# EAGLE board moire_v2.7 (EAGLE 9.1.1)
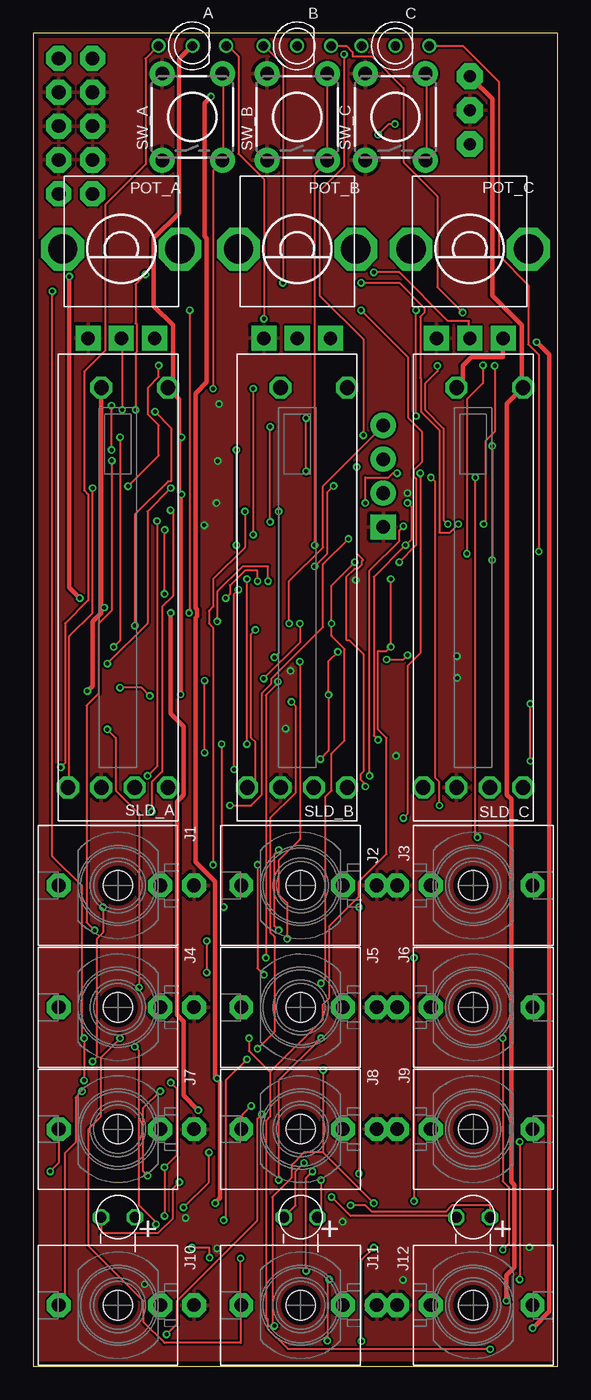
[diagram p3: board, top side]
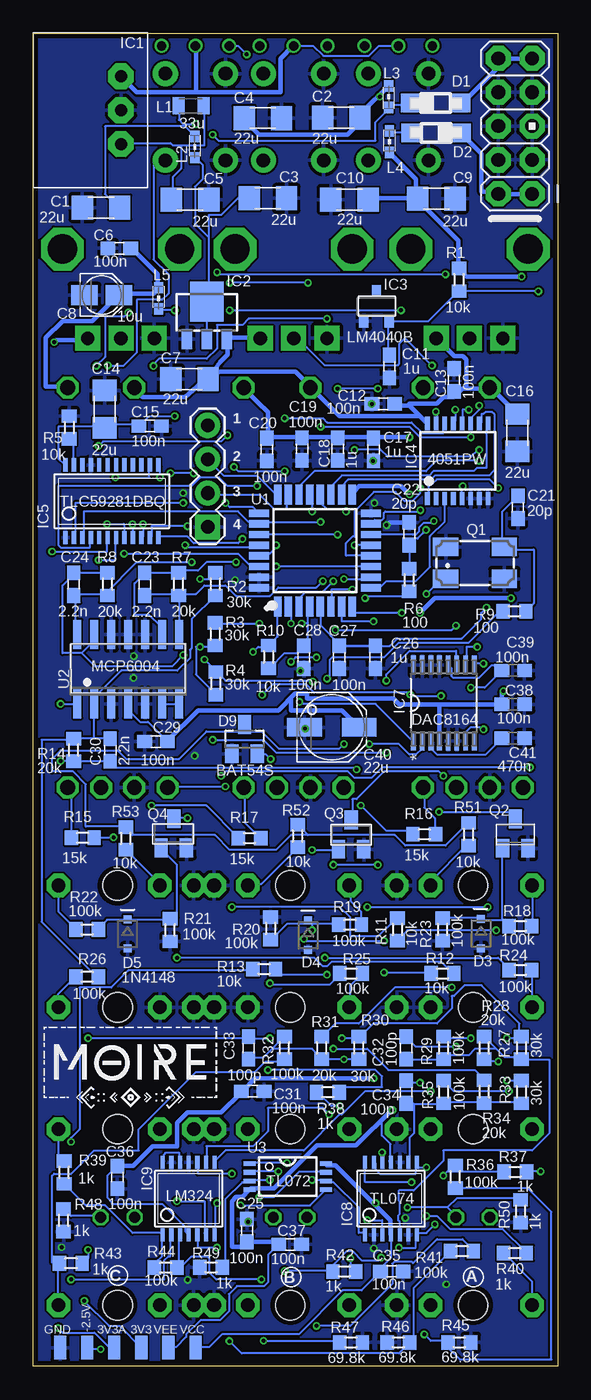
[diagram p4: board, bottom side, seen from below]

Size 39.35 x 100 mm. Coordinates in mm from the lower left corner, seen from the top.
Outline: 0,0 39.35,0 39.35,100 0,100 0,0
Copper layers (1*16): Top 0.035559375mm / dielectric 1.6mm / Bottom 0.035559375mm
Design rules "pcbway": minimum track width 6mil, minimum drill 0.3mm, track to track 6mil, track to pad 6mil, pad to pad 6mil, via to via 6mil, smd to smd 0mil, copper to edge 15mil, drill to drill 6mil, minimum pad ring 5mil, minimum via ring 5mil, stop-mask expansion 2.5mil, vias tented up to drill 15mil, thermal gap 10mil

## Footprints (pad centres in the part's own frame; a part is rotated, then mirrored left to right if it is on the bottom)
LED-BICOLOR-THROUGHHOLE-LUMEX = drill 0.7: A 0,0; GREEN_C 2.54,0; RED_C -2.54,0
LED3MM = drill 0.813 octagon: 1 -1.27,0; 2 1.27,0
RCL_C1206 = smd 1.6 x 1.8: 1 -1.4,0; 2 1.4,0
RCL_C0603 = smd 1.1 x 1: 1 -0.85,0; 2 0.85,0
RCL_PANASONIC_A = smd 2 x 1.5: + 1.3,0; - -1.3,0
C0603 = smd 1.1 x 1: 1 -0.85,0; 2 0.85,0
PANASONIC_C = smd 2.6 x 1.4: + 2.05,0; - -2.05,0
DIODE_SOD123 = smd 1.4 x 1.4: A 1.9,0; C -1.9,0
DIODE_SOD323-R = smd 0.6 x 0.6: A 1.1,0; C -1.1,0
SOT23 = smd 1 x 1.4: 1 -0.95,-1.1; 2 0.95,-1.1; 3 0,1.1
WE78 = drill 0.9 pad 1.93 octagon: 1 -2.54,0; 2 0,0; 3 2.54,0
SOT89 = smd 0.8 x 1.5: 1 -1.5,-1.75; 2 0,-1.75; 3 1.5,-1.75 | smd 2.5 x 3: 4 0,1.05
DBZ_R-PDSO-G3 = smd 0.7 x 1: 1 -0.95,-1.1; 2 0.95,-1.1; 3 0,1.1
TSSOP16_065 = smd 0.35 x 1: 1 -1.95,-2.825; 2 -1.3,-2.825; 3 -0.65,-2.825; 4 0,-2.825; 5 0.65,-2.825; 6 1.3,-2.825; 7 1.95,-2.825; 8 2.6,-2.825; 9 2.6,2.825; 10 1.95,2.825; 11 1.3,2.825; 12 0.65,2.825; 13 0,2.825; 14 -0.65,2.825; 15 -1.3,2.825; 16 -1.95,2.825
TSSOP24_0635 = smd 0.33 x 1: 1 -3.493,-2.725; 2 -2.857,-2.725; 3 -2.223,-2.725; 4 -1.587,-2.725; 5 -0.953,-2.725; 6 -0.318,-2.725; 7 0.318,-2.725; 8 0.953,-2.725; 9 1.587,-2.725; 10 2.223,-2.725; 11 2.857,-2.725; 12 3.493,-2.725; 13 3.493,2.725; 14 2.857,2.725; 15 2.223,2.725; 16 1.587,2.725; 17 0.953,2.725; 18 0.318,2.725; 19 -0.318,2.725; 20 -0.953,2.725; 21 -1.587,2.725; 22 -2.223,2.725; 23 -2.857,2.725; 24 -3.493,2.725
SOP65P640X110-16N = smd 1.422 x 0.356: 1 -2.845,2.286; 2 -2.845,1.626; 3 -2.845,0.965; 4 -2.845,0.33; 5 -2.845,-0.33; 6 -2.845,-0.965; 7 -2.845,-1.626; 8 -2.845,-2.286; 9 2.845,-2.286; 10 2.845,-1.626; 11 2.845,-0.965; 12 2.845,-0.33; 13 2.845,0.33; 14 2.845,0.965; 15 2.845,1.626; 16 2.845,2.286
TSSOP14_065 = smd 0.305 x 0.991: 1 -1.95,-2.718; 2 -1.3,-2.718; 3 -0.65,-2.718; 4 0,-2.718; 5 0.65,-2.718; 6 1.3,-2.718; 7 1.95,-2.718; 8 1.95,2.718; 9 1.3,2.718; 10 0.65,2.718; 11 0,2.718; 12 -0.65,2.718; 13 -1.3,2.718; 14 -1.95,2.718
WQP_PJ_301M6 = drill 1.016 pad 1.778 octagon: P1 0,-5.715; P2 0,-3.175; P3 0,4.445 | hole 2.2: 0,0
2X5-PTH = drill 1.016 pad 1.88 octagon: 1 -1.27,5.08; 2 1.27,5.08; 3 -1.27,2.54; 4 1.27,2.54; 5 -1.27,0; 6 1.27,0; 7 -1.27,-2.54; 8 1.27,-2.54; 9 -1.27,-5.08; 10 1.27,-5.08
1X04 = drill 1.016 pad 1.88 square: 1 0,0 | drill 1.016 pad 1.88: 2 2.54,0; 3 5.08,0; 4 7.62,0
L2012C = smd 0.9 x 1.25: 1 -0.9,0; 2 1,0
0603 = smd 0.85 x 0.7: 1 -0.9,0; 2 0.7,0
ALPS_POT_VERTICAL = drill 1 pad 1.88 square: P$1 -2.5,6.7; P$2 0,6.7; P$3 2.5,6.7 | drill 2.2 pad 3.175 octagon: P$4 -4.4,0; P$5 4.4,0
CTS406 = smd 1.9 x 1.4: 1 -2.2,-1.2; 2 2.2,-1.2; 3 2.2,1.2; 4 -2.2,1.2
SOT23-BEC = smd 1 x 1.4: B -0.95,-1.1; C 0,1.1; E 0.95,-1.1
RCL_R0603 = smd 1 x 1.1: 1 -0.85,0; 2 0.85,0
BOURNS_SLIDER = drill 1.1 octagon: 1 -15,1.25; 2 -15,3.75; 3 15,1.25; B 15,-3.75; DUMMY -15,-1.25; E -15,-3.75
TACTILE-PTH = drill 1.016 pad 1.88: 1 -3.251,2.261; 2 3.251,2.261; 3 -3.251,-2.261; 4 3.251,-2.261
QFP80P900X900X160-32N = smd 1.5 x 0.55: 1 -4.2,2.8; 2 -4.2,2; 3 -4.2,1.2; 4 -4.2,0.4; 5 -4.2,-0.4; 6 -4.2,-1.2; 7 -4.2,-2; 8 -4.2,-2.8; 17 4.2,-2.8; 18 4.2,-2; 19 4.2,-1.2; 20 4.2,-0.4; 21 4.2,0.4; 22 4.2,1.2; 23 4.2,2; 24 4.2,2.8 | smd 0.55 x 1.5: 9 -2.8,-4.2; 10 -2,-4.2; 11 -1.2,-4.2; 12 -0.4,-4.2; 13 0.4,-4.2; 14 1.2,-4.2; 15 2,-4.2; 16 2.8,-4.2; 25 2.8,4.2; 26 2,4.2; 27 1.2,4.2; 28 0.4,4.2; 29 -0.4,4.2; 30 -1.2,4.2; 31 -2,4.2; 32 -2.8,4.2
SO14 = smd 0.6 x 2.2: 1 -3.81,-2.6; 2 -2.54,-2.6; 3 -1.27,-2.6; 4 0,-2.6; 5 1.27,-2.6; 6 2.54,-2.6; 7 3.81,-2.6; 8 3.81,2.6; 9 2.54,2.6; 10 1.27,2.6; 11 0,2.6; 12 -1.27,2.6; 13 -2.54,2.6; 14 -3.81,2.6
TSSOP-8 = smd 0.9 x 0.35: 1 -2.875,0.975; 2 -2.875,0.325; 3 -2.875,-0.325; 4 -2.875,-0.975; 5 2.875,-0.975; 6 2.875,-0.325; 7 2.875,0.325; 8 2.875,0.975
6X1-SMD-TESTPAD = smd 0.914 x 1.778: 1 0,0.123; 2 -2.032,0.123; 3 -4.064,0.123; 4 -6.096,0.123; 5 -8.128,0.123; 6 -10.16,0.123

## Placement (x,y rotation side)
A  SSL-LX3059IGW-CA  [LED-BICOLOR-THROUGHHOLE-LUMEX]  11.94,99.06 180 top
A_LED  WP937EGW  [LED3MM]  6.35,11.18 0 top
B  SSL-LX3059IGW-CA  [LED-BICOLOR-THROUGHHOLE-LUMEX]  19.81,99.06 180 top
B_LED  WP937EGW  [LED3MM]  20.07,11.18 0 top
C  SSL-LX3059IGW-CA  [LED-BICOLOR-THROUGHHOLE-LUMEX]  27.18,99.06 180 top
C1  22u  [RCL_C1206]  34.26,86.92 180 bottom
C2  22u  [RCL_C1206]  16.23,93.68 180 bottom
C3  22u  [RCL_C1206]  21.74,87.63 0 bottom
C4  22u  [RCL_C1206]  22.12,93.65 0 bottom
C5  22u  [RCL_C1206]  27.58,87.5 0 bottom
C6  100n  [RCL_C0603]  32.89,83.87 180 bottom
C7  22u  [RCL_C1206]  27.64,74.07 180 bottom
C8  10u  [RCL_PANASONIC_A]  34.21,80.37 0 bottom
C9  22u  [RCL_C1206]  9.09,87.6 180 bottom
C10  22u  [RCL_C1206]  15.62,87.53 0 bottom
C11  1u  [RCL_C0603]  12.62,75.01 270 bottom
C12  100n  [RCL_C0603]  13.08,72.21 180 bottom
C13  100n  [RCL_C0603]  7.77,73.99 90 bottom
C14  22u  [RCL_C1206]  33.99,71.81 90 bottom
C15  100n  [RCL_C0603]  30.58,70.54 0 bottom
C16  22u  [RCL_C1206]  3.02,70.03 270 bottom
C17  1u  [RCL_C0603]  13.82,68.78 270 bottom
C18  1u  [RCL_C0603]  16.51,68.81 270 bottom
C19  100n  [RCL_C0603]  19.18,68.81 270 bottom
C20  100n  [RCL_C0603]  21.82,68.78 270 bottom
C21  20p  [RCL_C0603]  2.97,64.44 90 bottom
C22  20p  [RCL_C0603]  11.13,62.46 270 bottom
C23  2.2n  [RCL_C0603]  30.99,58.67 270 bottom
C24  2.2n  [RCL_C0603]  36.32,58.67 270 bottom
C25  100n  [RCL_C0603]  23.32,10.19 270 bottom
C26  1u  [RCL_C0603]  13.67,53.19 270 bottom
C27  100n  [RCL_C0603]  16.38,53.19 270 bottom
C28  100n  [RCL_C0603]  19.05,53.19 270 bottom
C29  100n  [RCL_C0603]  30.15,46.86 180 bottom
C30  2.2n  [RCL_C0603]  33.58,46.23 270 bottom
C31  100n  [RCL_C0603]  22.89,20.62 0 bottom
C32  100p  [RCL_C0603]  11.35,23.88 90 bottom
C33  100p  [RCL_C0603]  23.19,23.88 90 bottom
C34  100p  [RCL_C0603]  11.35,20.57 90 bottom
C35  100n  [RCL_C0603]  12.45,7.11 0 bottom
C36  100n  [RCL_C0603]  33.05,14.17 270 bottom
C37  100n  [RCL_C0603]  20.07,9.14 180 bottom
C38  100n  [C0603]  3.33,49.66 0 bottom
C39  100n  [C0603]  3.33,52.2 0 bottom
C40  22u  [PANASONIC_C]  16.94,47.93 0 bottom
C41  470n  [C0603]  3.33,47.12 0 bottom
C_LED  WP937EGW  [LED3MM]  33.02,11.18 0 top
D1  1N5819  [DIODE_SOD123]  9.14,94.77 0 bottom
D2  1N5819  [DIODE_SOD123]  9.12,92.53 180 bottom
D3  1N4148  [DIODE_SOD323-R]  5.74,32.46 270 bottom
D4  1N4148  [DIODE_SOD323-R]  18.72,32.33 270 bottom
D5  1N4148  [DIODE_SOD323-R]  32.28,32.44 270 bottom
D9  BAT54S  [SOT23]  23.5,47.04 0 bottom
IC1  R-78E3.3-0.5  [WE78]  32.77,94.23 90 bottom
IC2  AP7380  [SOT89]  26.31,78.82 0 bottom
IC3  LM4040B  [DBZ_R-PDSO-G3]  13.59,79.5 0 bottom
IC4  4051PW  [TSSOP16_065]  7.82,67.92 0 bottom
IC5  TLC59281DBQ  [TSSOP24_0635]  33.45,64.9 0 bottom
IC7  DAC8164  [SOP65P640X110-16N]  8.53,49.76 90 bottom
IC8  TL074  [TSSOP14_065]  12.5,12.57 0 bottom
IC9  LM324  [TSSOP14_065]  27.69,12.57 0 bottom
J1  PJ301_THONKICONN6  [WQP_PJ_301M6]  6.35,36.07 90 top
J2  PJ301_THONKICONN6  [WQP_PJ_301M6]  20.07,36.07 90 top
J3  PJ301_THONKICONN6  [WQP_PJ_301M6]  33.02,36.07 270 top
J4  PJ301_THONKICONN6  [WQP_PJ_301M6]  6.35,26.92 90 top
J5  PJ301_THONKICONN6  [WQP_PJ_301M6]  20.07,26.92 90 top
J6  PJ301_THONKICONN6  [WQP_PJ_301M6]  33.02,26.92 270 top
J7  PJ301_THONKICONN6  [WQP_PJ_301M6]  6.35,17.78 90 top
J8  PJ301_THONKICONN6  [WQP_PJ_301M6]  20.07,17.78 90 top
J9  PJ301_THONKICONN6  [WQP_PJ_301M6]  33.02,17.78 270 top
J10  PJ301_THONKICONN6  [WQP_PJ_301M6]  6.35,4.57 90 top
J11  PJ301_THONKICONN6  [WQP_PJ_301M6]  20.07,4.57 90 top
J12  PJ301_THONKICONN6  [WQP_PJ_301M6]  33.02,4.57 270 top
JP1  M05X2PTH  [2X5-PTH]  3.17,93.04 180 bottom
JP2  [1X04]  26.26,62.97 90 bottom
L1  33u  [L2012C]  27.56,94.56 0 bottom
L2  [0603]  27.23,91.57 90 bottom
L3  [0603]  12.67,95.15 270 bottom
L4  [0603]  12.62,91.97 90 bottom
L5  [0603]  29.95,80.21 90 bottom
POT_A  10kB  [ALPS_POT_VERTICAL]  6.6,83.82 180 top
POT_B  10kB  [ALPS_POT_VERTICAL]  19.81,83.82 180 top
POT_C  10kB  [ALPS_POT_VERTICAL]  32.77,83.82 180 top
Q1  8MHz  [CTS406]  6.2,60.27 0 bottom
Q2  MMBT3904  [SOT23-BEC]  3.17,39.95 0 bottom
Q3  MMBT3904  [SOT23-BEC]  15.49,39.88 0 bottom
Q4  MMBT3904  [SOT23-BEC]  28.8,39.98 0 bottom
R1  10k  [RCL_R0603]  7.39,81.51 270 bottom
R2  30k  [RCL_R0603]  25.68,58.67 90 bottom
R3  30k  [RCL_R0603]  25.7,54.91 270 bottom
R4  30k  [RCL_R0603]  25.65,51.23 270 bottom
R5  10k  [RCL_R0603]  36.65,70.43 90 bottom
R6  100  [RCL_R0603]  11.13,58.98 90 bottom
R7  20k  [RCL_R0603]  28.45,58.67 90 bottom
R8  20k  [RCL_R0603]  33.78,58.67 90 bottom
R9  100  [RCL_R0603]  3.23,56.64 0 bottom
R10  10k  [RCL_R0603]  21.69,53.21 270 bottom
R11  10k  [RCL_R0603]  12.01,32.77 270 bottom
R12  10k  [RCL_R0603]  8.64,29.46 180 bottom
R13  10k  [RCL_R0603]  22.02,29.79 0 bottom
R14  20k  [RCL_R0603]  36.32,46.23 90 bottom
R15  15k  [RCL_R0603]  35.64,39.65 0 bottom
R16  15k  [RCL_R0603]  10.01,39.9 180 bottom
R17  15k  [RCL_R0603]  23.11,39.62 180 bottom
R18  100k  [RCL_R0603]  2.79,33.02 180 bottom
R19  100k  [RCL_R0603]  15.57,33.12 180 bottom
R20  100k  [RCL_R0603]  21.54,32.84 270 bottom
R21  100k  [RCL_R0603]  29.08,32.72 90 bottom
R22  100k  [RCL_R0603]  35.31,32.77 0 bottom
R23  100k  [RCL_R0603]  8.64,32.77 90 bottom
R24  100k  [RCL_R0603]  2.79,29.72 0 bottom
R25  100k  [RCL_R0603]  15.49,29.46 0 bottom
R26  100k  [RCL_R0603]  35.31,29.21 180 bottom
R27  30k  [RCL_R0603]  2.72,23.88 90 bottom
R28  20k  [RCL_R0603]  5.51,23.88 270 bottom
R29  100k  [RCL_R0603]  8.56,23.88 270 bottom
R30  30k  [RCL_R0603]  14.91,23.88 90 bottom
R31  20k  [RCL_R0603]  17.7,23.88 90 bottom
R32  100k  [RCL_R0603]  20.5,23.88 90 bottom
R33  30k  [RCL_R0603]  2.72,20.57 90 bottom
R34  20k  [RCL_R0603]  5.51,20.6 90 bottom
R35  100k  [RCL_R0603]  8.56,20.57 270 bottom
R36  100k  [RCL_R0603]  7.67,14.22 270 bottom
R37  1k  [RCL_R0603]  3.17,14.58 180 bottom
R38  1k  [RCL_R0603]  17.25,20.55 0 bottom
R39  1k  [RCL_R0603]  37.03,14.53 270 bottom
R40  1k  [RCL_R0603]  3.2,8.48 0 bottom
R41  100k  [RCL_R0603]  7.16,8.64 180 bottom
R42  1k  [RCL_R0603]  16,7.11 180 bottom
R43  1k  [RCL_R0603]  36.53,7.72 0 bottom
R44  100k  [RCL_R0603]  29.41,7.39 0 bottom
R45  69.8k  [RCL_R0603]  7.37,1.78 0 bottom
R46  69.8k  [RCL_R0603]  11.94,1.78 180 bottom
R47  69.8k  [RCL_R0603]  15.49,1.78 0 bottom
R48  1k  [RCL_R0603]  37.08,10.95 270 bottom
R49  1k  [RCL_R0603]  26.01,7.42 180 bottom
R50  1k  [RCL_R0603]  2.77,11.63 270 bottom
R51  10k  [RCL_R0603]  6.68,39.9 270 bottom
R52  10k  [RCL_R0603]  19.51,39.78 270 bottom
R53  10k  [RCL_R0603]  32.41,39.6 270 bottom
SLD_A  20kB  [BOURNS_SLIDER]  6.35,58.42 90 top
SLD_B  20kB  [BOURNS_SLIDER]  19.81,58.42 90 top
SLD_C  20kB  [BOURNS_SLIDER]  33.02,58.42 90 top
SW_A  [TACTILE-PTH]  11.94,93.73 90 top
SW_B  [TACTILE-PTH]  19.81,93.73 90 top
SW_C  [TACTILE-PTH]  27.18,93.73 90 top
U1  STM32F303K8T6  [QFP80P900X900X160-32N]  18.21,61.19 90 bottom
U2  MCP6004  [SO14]  32.23,52.3 0 bottom
U3  TL072  [TSSOP-8]  20.24,14.22 0 bottom
U$1  1X6-SMD-TESTPAD  [6X1-SMD-TESTPAD]  27.18,1.27 0 bottom

## Tracks (layer width: path | path; a pad name or v marks a point on that pad's centre or on a via)
+3V3  (via drill 0.3)
  Top 0.152: v22.86,53.59 22.17,52.91 v22.17,50.37 22.17,46.18 v21.54,45.54 | v6.5,50.9 8.13,50.9 v8.74,50.29
  Top 0.356: 10.95,69.69 10.95,72.55 10.16,73.34 SLD_A.B 10.48,73.18 10.48,78.11 9.05,79.53 9.05,84.61 10.95,86.52 10.95,98.11 11.91,99.06 A.A | 10.95,69.69 10.95,65.56 v11.11,65.41 11.05,65.41 v11.05,50.39 | v35.52,4.91 35.52,6.83 36.11,7.42 36.11,13.59 35.88,13.82 35.88,42.55 35.56,42.86 35.56,72.23 36.67,73.34 SLD_C.B 36.67,73.5 36.67,78.11 34.45,80.33 34.45,95.09 32.86,96.68 IC1.3 | v11.11,69.69 10.95,69.69
  Bottom 0.152: B.A 18.34,99.06 17.58,98.31 14.17,98.31 13.41,99.06 A.A | v35.52,4.91 35.52,4.87 33.66,3.02 32.86,3.02 U$1.3 | 4.29,52.07 4.82,52.6 4.94,52.6 5.88,51.66 7.84,51.66 7.98,51.8 7.98,52.38 IC7.12 | R10.1 21.01,54.74 U1.1 | v22.17,50.37 21.41,51.13 18.86,51.13 18.27,50.54 11.05,50.54 v11.05,50.39 10.95,50.29 v8.74,50.29 | v22.86,53.59 22.48,53.98 21.75,53.98 | v21.54,45.54 21.88,45.88 22.54,45.88 | C39.1 5.47,50.9 v6.5,50.9
  Bottom 0.356: 4.29,52.07 C39.1 | 22.54,45.88 D9.2 | 21.75,53.98 R10.1 | U1.17 14.89,66.04 11.75,66.04 v11.11,65.41 | 27.15,95.57 31.59,95.57 32.7,96.68 IC1.3 | 27.15,95.57 20.8,95.57 20.8,98.11 19.84,99.06 B.A | C.A 27.15,99.06 27.15,95.73 27.15,95.57 | SLD_B.B 23.5,73.34 22.46,72.31 21.75,71.6 21.75,69.85 C20.1 21.75,69.69 19.21,69.69 C19.1 19.05,69.69 16.67,69.69 C18.1 16.51,69.69 13.97,69.69 C17.1 13.65,69.69 v11.11,69.69 | C6.1 31.91,83.82 30,81.92 30,80.96 L5.2 30,80.8 30.32,80.49 32.86,80.49 C8.+ 33.02,80.33 34.92,78.42 37.15,78.42 38.42,77.15 38.42,73.5 36.83,73.5 SLD_C.B
+3V3_A  (via drill 0.3)
  Top 0.152: v5.33,56.92 5.08,57.18 5.08,57.33
  Top 0.356: v37.48,2.85 38.73,4.11 38.73,75.88 v37.78,76.83 | SLD_C.3 31.91,73.5 32.23,73.82 32.23,75.06 32.89,75.72 35.24,75.72 35.24,76.99 POT_C.P$1 | v4.06,50.64 4.45,51.03 4.45,55.88 5.08,56.52 5.08,57.33 5.08,73.34 SLD_A.3
  Bottom 0.152: U2.4 32.23,49.24 31.33,48.35 30.75,48.35 29.3,46.9 | v37.48,2.85 37.14,2.51 34.75,2.51 33.64,1.39 U$1.4 | U1.5 17.81,55.59 16.35,54.13 | C26.1 C27.1 12.59,54.04 12.03,54.6 7.19,54.6 5.74,56.05 5.74,56.52 v5.33,56.92
  Bottom 0.356: IC7.4 8.86,49.64 | 16.35,54.13 C27.1 | C40.+ 14.92,47.94 16.19,49.21 20,49.21 20,49.37 20,50.16 19.71,50.46 | 19.71,50.46 19.56,50.46 18.8,50.46 18.8,50.09 12.32,50.09 11.86,49.64 8.86,49.64 | 11.11,72.07 10.4,71.36 | 10.4,71.36 9.84,70.8 IC4.16 | 11.11,72.07 12.22,72.07 C12.1 | 6.83,73.34 5.24,73.34 SLD_A.3 5,73.42 3.02,71.44 C16.1 | 6.83,73.34 7.14,73.34 7.33,73.16 C13.1 7.79,72.71 8.57,72.71 9.05,72.23 11.11,72.23 11.11,72.07 | 6.83,73.34 6.83,73.5 6.83,75.53 7.09,75.79 7.75,75.79 9.07,77.12 POT_A.P$1 | POT_B.P$1 22.38,77.15 24.76,77.15 IC2.3 24.77,76.66 24.77,75.88 25.32,75.33 C7.1 | C7.1 25.33,74.61 19.68,74.61 18.57,73.5 SLD_B.3 18.41,73.34 16.35,71.28 10.48,71.28 10.4,71.36 | SLD_C.3 31.75,73.34 31.13,72.72 27.97,72.72 26.42,74.07 C7.1 | v37.78,76.83 37.62,76.99 35.4,76.99 POT_C.P$1 | C29.1 29.3,46.9 26.99,49.21 25.38,49.21 20.95,49.21 19.71,50.46 | 8.86,49.64 8.73,49.64 8.1,49.64 4.19,49.64 C38.1 4.18,50.51 v4.06,50.64
+12V
  Bottom 0.356: D1.A 7.14,94.77 4.45,97.47 4.45,98.11 JP1.10 4.29,98.11 1.91,98.11 JP1.9
-12V
  Bottom 0.356: D2.C 7.14,92.39 5.71,90.96 5.71,88.11 4.45,88.11 JP1.2 4.29,87.95 1.91,87.95 JP1.1
A_CV  (via drill 0.3)
  Top 0.152: v11.69,56.52 11.75,56.57 v11.75,79.22 | v24.61,79.22 28.12,75.7 28.12,71.17 29.16,70.14 29.16,67.81 28.55,67.2 28.55,66.78 28.73,66.59 28.73,61.59 v27.46,60.33
  Bottom 0.152: 33.97,57.94 36.2,57.94 C24.2 36.2,57.78 36.2,54.93 U2.14 | 33.97,57.94 33.81,57.94 R8.1 33.97,57.94 | v11.69,56.52 15.08,56.52 15.4,56.83 U1.8 | v24.61,79.22 v11.75,79.22 | v27.46,60.33 31.59,60.33 33.97,57.94
A_CV_IN
  Bottom 0.152: R24.2 1.91,29.69 1.91,26.99 J4.P3
A_GATE  (via drill 0.3)
  Top 0.152: v4.6,32.7 3.99,33.31 3.99,49.55 4.92,50.48 4.92,55.72 5.9,56.7 v5.9,67.93
  Bottom 0.152: v4.6,32.7 11.27,32.7 12,31.97 R11.2 | U1.22 19.37,65.41 19.37,66.04 18.26,67.15 9.88,67.15 9.11,67.93 v5.9,67.93
A_GATE_OUT  (via drill 0.3)
  Top 0.152: v1.27,14.61 1.91,15.24 J7.P3
  Bottom 0.152: v1.27,14.61 2.22,14.61 R37.1
A_LED  (via drill 0.3)
  Top 0.152: v10.95,13.81 10.48,13.34 10.48,11.11 9.37,10 5.08,10 5.08,11.11 A_LED.1
  Bottom 0.152: v10.95,13.81 14.45,13.81 14.45,15.24 IC8.14
A_OUT  (via drill 0.3)
  Top 0.152: v3.65,20.64 3.17,20.16 3.17,16.79 2.36,15.98 2.36,5.06 1.91,4.6 J10.P3
  Bottom 0.152: R40.1 3.97,8.41 1.91,6.35 1.91,4.6 J10.P3 | v3.65,20.64 7.78,20.64 8.41,21.27 R35.1
A_POT  (via drill 0.3)
  Top 0.152: v6.67,71.75 6.67,76.99 POT_A.P$2
  Bottom 0.152: v6.67,71.75 7.14,71.75 7.14,70.8 IC4.12
A_SLD  (via drill 0.3)
  Top 0.152: v4.45,65.88 4.45,56.52 2.7,54.77 2.7,43.5 SLD_A.2
  Bottom 0.152: IC4.1 9.68,65.25 9.68,66.19 9.66,66.21 9.39,66.21 9.07,66.53 5.09,66.53 v4.45,65.88
A_TRIG  (via drill 0.3)
  Top 0.152: v8.89,41.59 8.89,43.81 9.68,44.61 9.68,56.99 10.48,57.78 10.48,64.03 v10.29,64.22
  Bottom 0.152: v8.89,41.59 3.65,41.59 3.17,41.12 Q2.C | v10.29,64.22 10.38,64.14 12.93,64.14 13.03,64.03 13.03,63.62 13.17,63.48 13.71,63.48 U1.15
A_TRIG_IN
  Bottom 0.152: R18.1 1.91,33.02 1.91,36.04 J1.P3
ADC_TIME_SHAPE
  Bottom 0.152: U1.9 13.97,58.42 13.34,58.42 12.86,58.9 10.64,58.9 9.58,59.96 9.58,62.27 8.47,63.37 IC4.3
AREF_-2.5  (via drill 0.3)
  Top 0.152: v26.83,59.05 v26.83,53.98 26.51,53.66 25.88,53.66 25.88,47.78 26.51,47.15 26.51,38.42 24.45,36.35 24.45,35.24 22.23,33.02 22.23,27.62 21.75,27.15 21.75,26.04 17.78,22.07 | v3.81,21.43 v3.81,24.61 3.65,24.77 3.65,36.04 1.43,38.26 v1.43,80.64 | 17.78,22.07 17.78,18.73 17.46,18.41 17.46,3.66 17.59,3.53 17.59,2.81 19.11,1.29 34.27,1.29 v34.29,1.27 | 17.78,22.07 16.19,23.65 v16.19,24.61
  Bottom 0.152: C11.1 12.7,75.88 12.7,78.26 IC3.2 12.54,78.42 9.68,78.42 7.46,80.64 R1.2 7.3,80.64 v1.43,80.64 | R4.2 25.72,50.48 27.15,51.91 27.15,53.98 v26.83,53.98 25.72,53.98 R3.2 | v26.83,59.05 26.04,59.05 25.72,59.37 R2.2 | v3.81,21.43 2.86,21.43 R33.2 | v3.81,24.61 2.86,24.61 R27.2 2.86,24.77 2.86,25.72 5.71,28.57 6.99,28.57 7.78,27.78 7.94,27.78 7.94,26.83 9.05,25.72 13.81,25.72 14.76,24.77 R30.2 14.92,24.61 v16.19,24.61 | v34.29,1.27 35.24,1.27 U$1.5
B_CV  (via drill 0.3)
  Top 0.152: v13.81,55.88 13.81,58.1 15.72,60.01 17.62,60.01 v17.62,58.9
  Bottom 0.152: R7.1 28.57,57.94 30.96,57.94 C23.2 | v13.81,55.88 16.19,55.88 16.19,56.83 U1.7 | v17.62,58.9 18.1,58.42 20.95,58.42 21.59,57.78 24.13,57.78 24.92,58.58 26.51,58.58 27.15,57.94 28.42,57.94 R7.1 | U2.8 28.42,54.93 28.42,57.78 R7.1
B_CV_IN
  Bottom 0.152: R25.2 14.76,29.37 15.56,28.57 15.56,26.99 J5.P3
B_GATE  (via drill 0.3)
  Top 0.152: v13.02,31.91 v13.02,29.53 | v19.05,32.07 19.05,34.77 18.41,35.4 18.41,37.94 20,39.53 v20,52.86 | v18.1,53.18 18.41,53.5 v18.41,64.14
  Bottom 0.152: v13.02,29.53 9.53,29.53 R12.2 | v13.02,31.91 18.89,31.91 v19.05,32.07 | v20,52.86 19.68,53.18 v18.1,53.18 | v18.41,64.14 18.41,65.25 18.57,65.25 U1.21
B_GATE_OUT  (via drill 0.3)
  Top 0.152: v16.35,19.53 15.72,18.89 15.72,17.78 J8.P3
  Bottom 0.152: v16.35,19.53 16.99,19.53 17.94,20.48 R38.1
B_LED  (via drill 0.3)
  Top 0.152: v20.32,15.24 19.68,14.61 19.68,12.06 18.89,11.27 B_LED.1
  Bottom 0.152: v20.32,15.24 23.02,15.24 U3.1
B_OUT  (via drill 0.3)
  Top 0.152: v15.56,8.1 15.56,4.6 J11.P3 15.56,4.45 15.56,1.75 9.84,1.75 8.26,3.33 8.26,4.92 4.13,9.05 4.13,17.78 5.08,18.73 5.08,23.18 v6.51,24.61
  Bottom 0.152: v15.56,8.1 15.56,7.46 15.24,7.14 R42.1 | v6.51,24.61 8.41,24.61 R29.1
B_POT  (via drill 0.3)
  Top 0.152: v7.11,66.03 9.42,68.33 9.42,70.59 8.63,71.39 8.63,73.44 9.42,74.23 v9.42,75.08
  Bottom 0.152: IC4.5 7.17,65.97 v7.11,66.03 | v9.42,75.08 11.46,77.12 11.89,76.69 11.89,75.21 12.03,75.08 17.47,75.08 19.52,77.12 POT_B.P$2
B_SLD  (via drill 0.3)
  Top 0.152: v16.67,55.24 16.35,54.93 16.35,47.15 16.67,46.83 16.67,43.97 16.19,43.5 SLD_B.2 | v9.13,71.6 10.34,70.4 10.34,66.39 10.11,66.39 7.62,63.9 v7.62,55.56
  Bottom 0.152: v9.13,71.6 9.05,71.6 9.05,70.8 IC4.15 | v7.62,55.56 7.94,55.24 v16.67,55.24
B_TRIG  (via drill 0.3)
  Top 0.152: v8.57,44.29 9.28,45 v9.28,63.41
  Bottom 0.152: v8.57,44.29 8.89,44.61 13.02,44.61 15.08,42.55 15.4,42.55 15.4,41.12 Q3.C | U1.14 13.97,62.39 10.87,62.39 10.77,62.39 | v9.28,63.41 9.44,63.25 10.08,63.25 10.4,62.93 10.4,62.63 10.64,62.39 10.77,62.39 | 10.77,62.39
B_TRIG_IN
  Bottom 0.152: R19.1 14.76,33.18 14.76,34.13 15.56,34.92 15.56,36.04 J2.P3
C_CV  (via drill 0.3)
  Top 0.152: v15.4,58.26 15.08,57.94 v15.08,44.77 | v37.31,45.4 v37.31,49.69
  Bottom 0.152: v15.4,58.26 16.99,58.26 16.99,56.99 U1.6 | v15.08,44.77 15.24,44.93 33.18,44.93 33.5,45.24 C30.2 33.66,45.4 36.2,45.4 R14.1 36.35,45.4 v37.31,45.4 | v37.31,49.69 36.2,49.69 U2.1
C_CV_IN
  Bottom 0.152: R26.2 36.2,29.21 37.47,27.94 37.47,26.99 J6.P3
C_GATE  (via drill 0.3)
  Top 0.152: v17.3,29.37 16.83,29.84 v16.83,37.62 | v13.49,37.62 13.49,55.4 13.18,55.72 13.18,56.67 13.49,56.99 13.49,59.05 15.88,61.44 v15.88,64.14
  Bottom 0.152: v17.3,29.37 20.8,29.37 21.11,29.69 R13.2 | v13.49,37.62 v16.83,37.62 | v15.88,64.14 16.03,64.29 17.3,64.29 17.78,64.77 17.78,65.25 U1.20
C_GATE_OUT2
  Bottom 0.152: J9.P3 37.47,15.72 37.15,15.4 R39.1
C_LED  (via drill 0.3)
  Top 0.152: v22.38,12.7 23.81,11.27 31.75,11.27 C_LED.1
  Bottom 0.152: v22.38,12.7 21.27,12.7 19.37,14.61 17.46,14.61 U3.7
C_OUT
  Bottom 0.152: J12.P3 37.47,4.6 37.47,7.62 R43.1 37.47,7.78 37.94,7.78 37.94,14.29 37.78,14.45 36.51,14.45 34.77,16.19 31.43,16.19 31.43,17.78 27.15,22.07 22.7,22.07 21.91,22.86 20.8,22.86 20.64,23.02 R32.1
C_POT  (via drill 0.3)
  Top 0.152: v25.56,82.07 27.46,82.07 31.11,78.42 32.7,78.42 32.7,77.15 POT_C.P$2 | v8.41,81.92 7.68,81.18 7.68,78.25 7.77,78.15 7.77,76.09 7.68,75.99 v7.68,71.75
  Bottom 0.152: v7.68,71.75 7.68,70.94 IC4.13 | v8.41,81.92 25.4,81.92 v25.56,82.07
C_SLD  (via drill 0.3)
  Top 0.152: v20.48,67.15 v20.48,71.12 | v24.29,67.47 24.29,60.96 24.77,60.48 24.64,60.35 24.64,60.12 24.34,59.82 24.1,59.82 23.47,59.19 23.47,54.53 23.52,54.48 23.7,54.48 24.77,53.42 24.77,44.61 24.61,44.45 24.61,43.97 24.92,43.66 v24.92,43.5
  Bottom 0.152: v20.48,71.12 17.62,71.12 17.3,70.8 10.95,70.8 10.16,70.01 8.57,70.01 8.57,70.64 IC4.14 | v20.48,67.15 23.97,67.15 v24.29,67.47 | v24.92,43.5 29.21,43.5 SLD_C.2
C_TRIG  (via drill 0.3)
  Top 0.152: v27.78,41.12 28.1,41.43 28.1,52.55 29.05,53.5 v29.05,66.99 | v27.3,66.99 26.99,66.99 26.67,66.67 24.92,66.67 v24.92,64.77
  Bottom 0.152: v27.78,41.12 28.73,41.12 Q4.C | v27.3,66.99 v29.05,66.99 | v24.92,64.77 24.61,64.45 22.86,64.45 22.54,64.14 U1.25
C_TRIG_IN
  Bottom 0.152: R22.1 36.2,32.86 37.47,34.13 37.47,36.04 J3.P3
DAC_A  (via drill 0.3)
  Top 0.152: v16.83,23.81 18.1,25.08 18.1,32.23 17.78,32.54 17.78,41.12 19.68,43.02 19.68,49.53 v19.37,49.85
  Bottom 0.152: v16.83,23.81 14.29,23.81 12.7,22.23 6.19,22.23 5.56,21.59 R34.2 | v19.37,49.85 19.21,49.69 13.65,49.69 10.95,46.99 IC7.1
DAC_B  (via drill 0.3)
  Top 0.152: v4.45,22.86 4.76,23.18 4.76,32.07 5.24,32.54 v5.24,34.45 | v14.29,34.45 14.13,34.61 v14.13,46.67
  Bottom 0.152: v4.45,22.86 5.24,22.86 5.4,23.02 R28.2 | v14.29,34.45 v5.24,34.45 | v14.13,46.67 11.91,46.67 11.11,45.88 10.64,45.88 10.16,46.35 10.16,46.83 IC7.2
DAC_C  (via drill 0.3)
  Top 0.152: v7.94,28.42 7.94,41.43 6.19,43.18 6.19,47.15 v5.56,47.78
  Bottom 0.152: v7.94,28.42 12.22,28.42 14.92,25.72 16.67,25.72 17.62,24.77 R31.2 | v5.56,47.78 5.71,47.94 6.51,47.94 6.83,47.62 6.83,46.99 IC7.7
DAC_SS  (via drill 0.3)
  Top 0.152: v5.56,52.7 8.57,55.72 8.57,64.14 v10.32,65.88
  Bottom 0.152: v5.56,52.7 6.19,52.7 IC7.9 | v10.32,65.88 10.32,65.48 10.9,64.9 11.48,64.9 12.17,65.58 13.79,65.58 15.24,64.14 15.24,62.23 15.4,62.23 15.88,61.75 15.88,60.8 14.13,60.8 U1.12
GND  (via drill 0.3)
  Bottom 0.152: C25.1 23.25,10.93 23.22,10.9 v23.22,10.85
  Bottom 0.356: C22.1 12.61,63.31 v12.83,63.09
  other vias: 13.84,67.92 28.09,65.51 13.74,64.77 24.21,58.98 31.83,51.64 31.8,53.26 13.94,72.19 27.76,6.48 11.43,11.13 13.79,8.84 8.36,6.15 18.95,47.83 27.23,45.8 37.24,8.92 19.3,52.17
  pour Bottom: 39.88,100.74 -0.76,100.74 -0.76,-0.25 0,-1.02 39.88,-1.02
  pour Top: 0,-1.78 39.37,-1.78 40.39,-0.76 40.39,101.93 -2.03,101.93 -2.03,0.25
GRN_A  (via drill 0.3)
  Top 0.152: v27.78,63.02 27.46,62.71 27.46,61.91 25.24,59.69 v25.24,44.29 | v2.06,44.93 2.38,45.24 2.38,55.72 4.13,57.47 4.13,65.41 3.81,65.72 3.81,74.61 5.4,76.2 5.4,87.15 8.41,90.17 8.41,98.11 9.37,99.06 A.GREEN_C
  Bottom 0.152: v27.78,63.02 30.48,63.02 30.48,62.23 IC5.11 | v25.24,44.29 24.92,44.61 15.72,44.61 15.24,44.13 13.97,44.13 13.18,44.93 v2.06,44.93
GRN_B  (via drill 0.3)
  Top 0.152: v31.91,63.18 31.27,62.55 30.48,62.55 30.48,70.25 29.1,71.62 29.1,74.08 29.05,74.14 29.05,78.74 29.37,79.06 29.37,79.38 27.46,81.28 v24.61,81.28 | v18.73,81.28 18.73,97.63 17.3,99.06 B.GREEN_C
  Bottom 0.152: v31.91,63.18 31.91,62.23 IC5.9 | v18.73,81.28 v24.61,81.28
GRN_C  (via drill 0.3)
  Top 0.152: v34.45,69.04 v34.45,60.48 | v24.77,69.85 24.77,77.05 21.49,80.32 21.49,88.16 23.34,90.01 v23.34,98.42
  Bottom 0.152: v34.45,60.48 33.18,60.48 33.18,62.07 IC5.7 | v34.45,69.04 34.11,69.37 25.24,69.37 v24.77,69.85 | v23.34,98.42 23.97,99.06 24.61,99.06 C.GREEN_C
LEDS_SS  (via drill 0.3)
  Top 0.152: v22.54,66.04 22.07,65.56 22.07,60.96 v21.11,60.01
  Bottom 0.152: v22.54,66.04 24.77,66.04 25.4,66.67 26.83,66.67 27.46,66.04 37.47,66.04 37.47,61.59 37.31,61.44 35.08,61.44 35.08,62.07 IC5.4 | v21.11,60.01 14.13,60.01 U1.11
N$1  (via drill 0.3)
  Top 0.152: v23.65,62.07 21.75,60.17 21.75,55.45 18.11,51.82 18.11,51.81 17.86,51.56 17.86,51.2 17.14,50.48 17.14,42.86 16.35,42.07 v14.76,42.07
  Bottom 0.152: v23.65,62.07 23.97,61.75 27.3,61.75 27.78,62.23 29.84,62.23 IC5.12 | v14.76,42.07 12.86,40.16 11.11,40.16 10.95,40.01 R16.2
N$3
  Bottom 0.152: L4.2 12.54,92.55 11.11,92.55 D2.A
N$4  (via drill 0.3)
  Top 0.152: v25.88,92.39 26.67,93.19 v27.15,93.19
  Bottom 0.152: D1.C 11.11,94.61 12.38,94.61 12.54,94.46 L3.2 12.7,94.3 13.65,93.34 13.65,91.96 25.44,91.96 v25.88,92.39 | 28.1,93.19 28.42,93.5 28.42,94.46 L1.1 | 28.1,93.19 27.94,93.03 | 27.94,93.03 27.3,92.39 L2.2 | 27.94,93.03 33.97,93.03 33.97,87.95 33.02,87 C1.1 | 28.1,93.19 v27.15,93.19
N$5
  Bottom 0.152: 26.35,79.78 26.35,77.14 IC2.2 | 26.35,79.78 IC2.4 26.19,79.89 26.19,84.71 | L2.1 27.15,90.65 26.66,90.16 26.66,89.05 27.21,88.5 27.21,85.73 26.19,84.71 | C3.1 23.18,87.63 23.97,87.63 25.24,86.36 26.19,86.36 26.19,84.71 | 26.35,79.78 26.35,77.31
N$6
  Bottom 0.152: IC9.12 28.42,15.4 28.42,16.03 29.37,16.03 29.53,15.88 29.53,15.4 IC9.14
N$8
  Bottom 0.152: C32.1 11.27,23.02 8.57,23.02 R29.2 8.41,23.18 8.26,23.34 6.67,23.34 6.19,23.81 4.6,23.81 | 4.6,23.81 3.97,23.18 2.86,23.18 R27.1 2.7,23.02 0.64,23.02 0.64,17.46 1.91,16.19 8.57,16.19 8.57,15.4 10.79,13.18 11.91,13.18 11.91,12.39 11.85,12.34 11.85,11.42 11.94,11.34 11.94,10.92 11.85,10.83 IC8.5 | 4.6,23.81 5.4,24.61 R28.1
N$9  (via drill 0.3)
  Top 0.152: v17.29,51.58 20,54.29 v20,55.72
  Bottom 0.152: v20,55.72 20,56.83 20.16,56.83 U1.2 | R9.1 4.42,56.53 6.67,54.29 11.91,54.29 13.02,53.18 16.91,53.18 17.11,52.98 17.11,51.73 17.29,51.73 v17.29,51.58
N$10  (via drill 0.3)
  Top 0.152: v14.45,57.63 14.76,57.94 14.76,58.58 15.88,59.69 16.83,59.69 v16.83,58.9
  Bottom 0.152: v14.45,57.63 14.29,57.78 11.59,57.78 11.27,58.1 R6.1 | v16.83,58.9 17.62,58.1 18.89,58.1 19.37,57.63 19.37,56.99 U1.3
N$11
  Bottom 0.152: C21.2 3.02,65.25 4.13,64.14 4.13,61.7 Q1.3 3.96,61.28 1.79,61.28 1.79,57.23 R9.2
N$12  (via drill 0.3)
  Top 0.152: v9.87,62.74 9.87,57.97 v9.84,57.94
  Bottom 0.152: R6.2 11.11,59.85 11.11,61.59 C22.2 11.12,61.68 10.72,62.08 10.51,62.08 10.09,62.5 10.09,62.71 10.06,62.74 v9.87,62.74 | v9.84,57.94 8.89,58.9 8.44,58.9 Q1.1
N$13
  Bottom 0.152: R51.2 6.83,39.05 9.53,36.35 9.53,36.2 J1.P2
N$14
  Bottom 0.152: R52.2 19.53,38.89 22.23,36.2 23.18,36.2 J2.P2
N$15  (via drill 0.3)
  Top 0.152: v20.95,14.61 20.48,14.13 v20.48,7.14 | v11.91,8.89 13.23,8.89 v13.23,8.15 | v7.62,23.97 7.94,23.65 7.94,12.06 9.21,10.79 v9.21,10.64
  Bottom 0.152: v20.95,14.61 23.02,14.61 U3.2 | v20.48,7.14 16.99,7.14 R42.2 16.83,7.14 16.83,7.62 15.85,8.6 15.35,8.6 14.66,7.92 13.46,7.92 v13.23,8.15 | v11.91,8.89 10.64,8.89 10.64,9.84 IC8.7 10.48,10 9.84,10 v9.21,10.64 | v7.62,23.97 10.64,23.97 11.27,24.61 C32.2
N$16
  Bottom 0.152: R44.1 30.16,7.46 30.16,7.78 29.69,8.26 29.69,9.84 IC9.1 29.69,10 31.91,10 33.97,12.06 35.4,12.06 36.99,13.65 R39.2
N$17
  Bottom 0.152: R53.2 32.38,38.73 29.84,36.2 J3.P2
N$18
  Bottom 0.152: R33.1 2.86,19.84 5.4,19.84 R34.1 5.56,19.84 8.41,19.84 R35.2 8.57,19.68 10.79,19.68 | 10.79,19.68 10.79,17.46 11.11,17.14 11.11,15.4 IC8.9 | 10.79,19.68 11.27,19.68 C34.1
N$19  (via drill 0.3)
  Top 0.152: v9.84,11.27 v9.84,14.92 10.79,15.88 10.79,20.8 v10.32,21.27
  Bottom 0.152: 10.64,14.92 10.64,14.45 13.34,14.45 13.65,14.76 13.65,15.24 IC8.13 | 10.64,14.92 10.64,15.24 IC8.8 10.64,14.92 | v9.84,11.27 9.05,11.27 8.1,10.32 4.13,10.32 2.38,8.57 R40.2 | 10.64,14.92 v9.84,14.92 | v10.32,21.27 11.27,21.27 C34.2
N$24  (via drill 0.3)
  Top 0.152: v22.07,1.91 22.07,6.35 v22.23,6.51
  Bottom 0.152: IC9.3 28.42,9.84 28.42,7.46 R44.2 28.42,7.3 27.52,8.2 26.27,8.2 26.13,8.06 26.13,7.01 25.62,6.51 v22.23,6.51 | v22.07,1.91 16.35,1.91 R47.1
N$25  (via drill 0.3)
  Top 0.152: v36.51,16.83 v36.51,6.51
  Bottom 0.152: v36.51,6.51 29.53,6.51 29.53,7.94 29.21,8.26 29.05,8.26 29.05,9.84 IC9.2 | v36.51,16.83 36.51,17.14 35.88,17.78 35.88,28.42 33.5,28.42 32.23,29.69 23.02,29.69 R13.1
N$26  (via drill 0.3)
  Top 0.152: 21.75,16.03 v25.56,12.22 | v21.75,22.23 21.75,16.03 | v18.1,3.02 17.94,3.17 17.94,12.7 19.37,14.13 19.37,15.08 20.32,16.03 21.75,16.03
  Bottom 0.152: v25.56,12.22 25.72,12.22 25.72,10 IC9.7 | v21.75,22.23 13.65,22.23 13.18,21.75 13.18,20.95 16.03,20.95 16.35,20.64 R38.2 | v18.1,3.02 15.56,3.02 12.98,5.59 12.39,6.18 12.39,7.69 12.24,7.84 10.95,7.84 | R41.1 6.35,8.73 7.14,9.53 9.05,9.53 10.28,8.3 10.83,7.75 10.86,7.75 | 10.86,7.75 10.95,7.84 | 10.86,7.75 10.95,7.84
N$27
  Bottom 0.152: R16.1 9.21,40.01 9.21,41.12 10,41.91 10,43.34 SLD_A.E
N$28  (via drill 0.3)
  Top 0.152: v25.56,8.89 24.63,7.96 v24.63,1.87
  Bottom 0.152: v25.56,8.89 26.99,8.89 26.99,9.84 IC9.5 | v24.63,1.87 23.71,0.95 11.91,0.95 11.11,1.75 R46.1 10.95,1.91 10.79,1.91 10.79,5.87 8.1,8.57 R41.2
N$29  (via drill 0.3)
  Top 0.152: v28.57,30.64 v28.57,12.38
  Bottom 0.152: v28.57,12.38 26.51,12.38 26.51,10 IC9.6 | v28.57,30.64 18.26,30.64 17.62,30 17.3,30 16.99,30.32 8.73,30.32 7.94,29.53 R12.1
N$30  (via drill 0.3)
  Top 0.152: v9.53,20.64 8.26,19.37 8.26,14.61 v8.57,14.29
  Bottom 0.152: v9.53,20.64 14.45,20.64 16.19,18.89 16.35,18.89 19.05,16.19 24.92,16.19 25.72,15.4 IC9.8 | 8.26,14.61 7.94,14.92 7.78,14.92 R36.1 | 8.26,14.61 v8.57,14.29 | 8.26,14.61 4.13,14.61 R37.2
N$38  (via drill 0.3)
  Top 0.152: v29.84,66.67 30.16,66.36 30.16,44.13 30.48,43.81 v30.48,42.07
  Bottom 0.152: v29.84,66.67 29.84,67.47 IC5.13 | v30.48,42.07 26.35,42.07 23.97,39.69 R17.2
N$39  (via drill 0.3)
  Top 0.152: v33.18,66.67 33.18,39.85 v33.34,39.69
  Bottom 0.152: v33.18,66.67 30.64,66.67 30.64,67.47 IC5.14 | v33.34,39.69 34.77,39.69 R15.2
N$40  (via drill 0.3)
  Top 0.152: v21.59,13.97 21.59,11.43 21.43,11.27 B_LED.2
  Bottom 0.152: R49.1 25.08,7.46 24.92,7.46 24.92,12.54 23.65,13.81 23.18,13.81 U3.3 23.02,13.97 v21.59,13.97
N$41
  Bottom 0.152: R23.2 8.57,33.66 5.87,33.66 D3.C 5.71,33.5 4.13,33.5 | 4.13,33.5 3.65,33.02 R18.2 4.13,33.5 | 4.13,33.5 4.13,38.73 Q2.B
N$43
  Bottom 0.152: R17.1 22.38,39.69 23.5,40.8 23.5,43.34 SLD_B.E
N$44  (via drill 0.3)
  Top 0.152: v28.73,71.28 v28.73,79.22
  Bottom 0.152: IC5.24 36.99,67.63 37.47,68.1 37.47,70.48 34.1,70.48 C14.1 33.94,70.64 31.43,70.64 C15.1 31.27,70.64 30.64,71.28 v28.73,71.28 | v28.73,79.22 29.84,79.22 L5.1
N$45
  Bottom 0.152: R15.1 36.51,39.69 36.51,43.34 36.67,43.34 SLD_C.E
N$52  (via drill 0.3)
  Top 0.152: v11.27,11.91 13.18,13.81 v13.18,16.03
  Bottom 0.152: v13.18,16.03 13.18,15.4 IC8.12 | 8.26,11.91 v11.27,11.91 | 8.26,11.91 7.62,11.27 A_LED.2 | 8.26,11.91 7.54,12.62 2.91,12.62 R50.1
N$57
  Bottom 0.152: R2.1 25.72,57.78 27.46,56.04 27.46,53.87 27.59,53.74 27.59,53.13 28.54,52.18 32.75,52.18 34.77,50.16 34.77,49.85 U2.2 34.77,47.15 | R26.1 34.61,29.21 38.73,33.34 38.73,46.99 36.35,46.99 R14.2 36.2,47.15 34.77,47.15 | 34.77,47.15 33.66,47.15 C30.1
N$58  (via drill 0.3)
  Top 0.152: v21.59,28.73 21.91,29.05 21.91,42.7 22.38,43.18 22.38,45.96 23.37,46.94 23.37,53.8 22.38,54.78 v22.38,55.72 22.38,58.58 v24.13,60.33
  Bottom 0.152: U2.9 29.84,54.93 29.84,55.56 30.64,56.36 31.75,56.36 31.75,58.74 31.11,59.37 C23.1 30.96,59.53 28.57,59.53 R7.2 28.42,59.53 28.26,59.69 26.99,59.69 26.35,60.33 v24.13,60.33 | v22.38,55.72 25.56,55.72 R3.1 | R25.1 16.35,29.37 17.09,28.63 21.49,28.63 v21.59,28.73
N$59  (via drill 0.3)
  Top 0.152: v17.46,30.64 17.46,50.35 18.36,51.25 v18.36,51.35 | v28.1,53.34 27.78,53.02 v26.51,53.02
  Bottom 0.152: R8.2 33.81,59.53 36.2,59.53 C24.1 36.35,59.37 37.15,58.58 37.15,53.5 35.72,53.5 | 35.72,53.5 34.92,54.29 34.92,54.77 U2.13 | v17.46,30.64 4.45,30.64 3.65,29.84 R24.1 | v18.36,51.35 18.45,51.44 24.92,51.44 25.56,52.07 R4.1 25.72,52.23 v26.51,53.02 | 35.72,53.5 34.72,52.5 28.94,52.5 v28.1,53.34
N$61  (via drill 0.3)
  Top 0.152: v17.14,18.89 16.83,18.57 16.83,10.95 10.79,4.92 10.79,3.17 v10,2.38
  Bottom 0.152: v17.14,18.89 17.62,19.37 21.75,19.37 21.75,17.62 22.86,16.51 26.35,16.51 26.35,15.4 IC9.9 | v10,2.38 9.53,1.91 8.26,1.91 R45.1 8.22,1.4 7.33,0.51 0.46,0.51 0.46,11.57 2.22,13.34 7.62,13.34 R36.2
N$62  (via drill 0.3)
  Top 0.152: v18.41,38.73 18.1,38.42 18.1,33.02 v18.41,32.7
  Bottom 0.152: 18.41,33.18 18.57,33.34 D4.C | 18.41,33.18 16.51,33.18 R19.2 | 18.41,33.18 20.32,33.18 21.43,32.07 R20.2 | v18.41,38.73 16.51,38.73 Q3.B | 18.41,33.18 v18.41,32.7
N$64  (via drill 0.3)
  Top 0.152: v24.45,34.45 v24.45,14.45
  Bottom 0.152: v24.45,14.45 26.99,14.45 26.99,15.24 IC9.10 | v24.45,34.45 16.35,34.45 15.56,33.66 15.56,32.23 13.49,32.23 12.22,33.5 12.14,33.5 R11.1
N$65
  Bottom 0.152: R22.2 34.45,32.86 33.81,33.5 32.38,33.5 D5.C 32.23,33.5 29.21,33.5 R21.2 29.05,33.66 28.57,33.66 28.57,37.62 29.69,38.73 Q4.B
N$66
  Bottom 0.152: 28.26,91.6 28.89,91.6 29.05,91.76 32.7,91.76 IC1.1 | 28.26,91.6 26.51,91.6 26.51,94.46 L1.2 | 28.26,91.6 28.26,89.85 28.89,89.22 28.89,87.63 C5.1
N$68
  Bottom 0.152: IC5.23 36.35,67.63 36.35,69.53 36.51,69.53 R5.1
N$84  (via drill 0.3)
  Top 0.152: v23.81,12.06 24.92,12.06 25.4,11.59 30.96,11.59 31.43,12.06 34.29,12.06 34.29,11.27 C_LED.2
  Bottom 0.152: v23.81,12.06 18.57,12.06 17.46,13.18 U3.5 | R48.1 36.99,11.75 36.51,11.27 34.29,11.27 C_LED.2
N$87  (via drill 0.3)
  Top 0.152: v14.29,10.95 14.45,11.11 14.45,21.43 v16.03,23.02
  Bottom 0.152: 21.43,23.81 22.07,23.18 23.18,23.18 C33.1 | 21.43,23.81 20.64,24.61 R32.2 | v14.29,10.95 13.18,10.95 13.18,10 IC8.3 | R30.1 14.92,23.02 v16.03,23.02 17.62,23.02 R31.1 17.78,23.18 18.41,23.81 21.43,23.81
N$93  (via drill 0.3)
  Top 0.152: v35.24,24.61 35.24,13.88 35.7,13.42 35.7,9.19 v35.24,8.73 | v18.41,13.97 18.41,21.43 v21.59,24.61
  Bottom 0.152: IC8.1 14.45,10 14.92,10 14.92,11.91 16.83,13.81 17.3,13.81 U3.6 17.46,13.97 v18.41,13.97 | v35.24,8.73 35.24,8.1 35.56,7.78 R43.2 | v35.24,24.61 23.34,24.61 C33.2 23.18,24.61 v21.59,24.61
N_U
  Bottom 0.152: U2.7 28.57,49.69 U2.6
NORMALIZATION_PROBE  (via drill 0.3)
  Top 0.152: v16.03,46.67 v16.03,59.05
  Bottom 0.152: 18.73,39.85 19.37,40.48 R52.1 | 18.73,39.85 12.22,39.85 11.43,39.05 8.41,39.05 6.83,40.64 R51.1 | 18.73,39.85 20,39.85 21.11,38.73 24.61,38.73 25.72,39.85 31.91,39.85 32.38,40.32 R53.1 32.54,40.48 35.4,40.48 35.4,43.66 36.35,44.61 37.94,44.61 37.94,45.56 37.31,46.2 33.02,46.2 32.38,45.56 28.42,45.56 26.35,47.62 23.97,47.62 | 23.97,47.62 23.5,48.1 D9.3 23.97,47.62 | v16.03,59.05 14.13,59.05 U1.10 | 23.97,47.62 22.23,47.62 20.95,46.35 16.35,46.35 v16.03,46.67
POTS_ADDR_A  (via drill 0.3)
  Top 0.152: v5.87,68.74 v5.87,72.07 | v15.24,61.59 v15.24,68.74
  Bottom 0.152: v5.87,72.07 5.87,71.75 6.51,71.12 6.51,70.8 IC4.11 | v15.24,61.59 14.13,61.59 U1.13 | v15.24,68.74 15.19,68.74 15.16,68.76 13.28,68.76 12.74,68.23 6.5,68.23 5.99,68.74 v5.87,68.74
POTS_ADDR_B
  Bottom 0.152: IC4.10 5.71,70.8 5.71,71.44 5.56,71.44 5.4,71.6 4.92,71.6 4.76,71.44 4.76,67.16 4.81,67.16 5.13,66.84 9.19,66.84 9.51,66.52 15.72,66.52 16.19,66.04 16.19,65.41 U1.18
POTS_ADDR_C
  Bottom 0.152: IC4.9 5.34,69.98 5.34,67.39 6.05,67.39 6.28,67.16 9.3,67.16 9.63,66.83 16.19,66.83 16.99,66.04 16.99,65.41 U1.19
RED_A  (via drill 0.3)
  Top 0.152: v31.11,63.18 30.8,63.5 30.8,70.36 29.41,71.75 29.41,73.72 30.33,74.65 v30.33,75.04 | v17.3,78.58 17.3,89.06 15.4,90.96 15.4,98.27 14.61,99.06 A.RED_C
  Bottom 0.152: v31.11,63.18 31.11,62.23 IC5.10 | v17.3,78.58 23.18,78.58 23.65,78.11 25.56,78.11 25.56,76.36 26.34,75.58 29.92,75.58 30.33,75.17 v30.33,75.04
RED_B  (via drill 0.3)
  Top 0.152: v32.23,79.06 30.32,80.96 30.32,87.79 27.78,90.33 27.78,95.89 25.4,98.27 23.97,98.27 23.97,98.58 23.5,99.06 22.38,99.06 B.RED_C | v33.81,63.18 33.94,63.31 33.94,69.42 34.63,70.11 v34.63,75.06
  Bottom 0.152: v33.81,63.18 32.54,63.18 32.54,62.23 IC5.8 | v32.23,79.06 32.54,78.74 33.97,78.74 33.97,75.72 v34.63,75.06
RED_C  (via drill 0.3)
  Top 0.152: v37.94,61.12 37.94,75.88 37.15,76.68 37.15,81.12 34.92,83.34 34.92,96.36 32.23,99.06 29.84,99.06 C.RED_C
  Bottom 0.152: v37.94,61.12 33.81,61.12 33.81,62.07 IC5.6
RESET  (via drill 0.3)
  Top 0.152: v19.21,55.72 19.21,58.9 21.75,61.44 21.75,66.04 26.19,70.48 JP2.4
  Bottom 0.152: R10.2 21.59,52.39 20.48,53.5 19.53,53.5 19.05,53.98 C28.1 19.05,54.13 18.73,54.13 18.73,55.72 | 18.73,55.72 18.73,56.83 U1.4 | 18.73,55.72 v19.21,55.72
SPI_MOSI  (via drill 0.3)
  Top 0.152: v28.1,64.77 28.42,64.45 28.42,62.07 v27.94,61.59 25.56,59.21 25.56,47.31 v25.88,46.99 | v12.86,46.04 v12.86,51.44
  Bottom 0.152: v28.1,64.77 36.2,64.77 36.2,62.23 IC5.2 | v27.94,61.59 27.78,61.44 22.54,61.44 U1.28 | v12.86,51.44 12.86,51.91 11.11,53.66 7.62,53.66 7.62,52.7 IC7.11 | v12.86,46.04 21.11,46.04 22.07,46.99 v25.88,46.99
SPI_SCK  (via drill 0.3)
  Top 0.152: v6.03,53.98 6.51,54.45 v6.51,69.69 | v17.78,63.34 v17.78,70.48
  Bottom 0.152: IC5.3 35.56,62.23 35.56,64.14 23.97,64.14 23.18,63.34 22.54,63.34 U1.26 22.38,63.34 v17.78,63.34 | v6.03,53.98 6.83,53.98 6.83,52.7 IC7.10 | v6.51,69.69 10.32,69.69 11.11,70.48 v17.78,70.48
SW_MODE_A  (via drill 0.3)
  Top 0.152: v16.51,73.34 v16.51,62.39 | v13.49,73.34 13.49,89.69 14.13,90.33 SW_A.3 14.29,90.49 14.29,96.84 SW_A.4
  Bottom 0.152: v16.51,62.39 22.38,62.39 U1.27 | v13.49,73.34 v16.51,73.34
SW_MODE_B  (via drill 0.3)
  Top 0.152: v21.11,61.59 21.11,89.38 22.07,90.33 SW_B.3 22.07,90.49 22.07,96.84 SW_B.4
  Bottom 0.152: v21.11,61.59 21.11,61.44 21.59,60.96 22.23,60.96 22.38,60.8 U1.29
SW_MODE_C  (via drill 0.3)
  Top 0.152: v32.54,60.96 32.54,72.55 33.75,73.75 v33.75,75.09 | SW_C.4 29.53,96.84 29.53,90.49 SW_C.3
  Bottom 0.152: v32.54,60.96 23.97,60.96 23.18,60.17 22.7,60.17 22.54,60.01 U1.30 | SW_C.3 29.53,90.33 30.32,90.33 30.32,83.03 29.21,81.92 29.21,80.49 29.69,80.01 31.59,80.01 31.59,76.06 32.61,75.04 33.7,75.04 v33.75,75.09
SWCLK
  Bottom 0.152: U1.24 21.11,65.41 22.54,66.83 25.08,66.83 26.19,67.94 JP2.3
SWDIO
  Bottom 0.152: U1.23 20.32,65.25 20.32,64.29 21.27,64.29 22.38,65.41 26.19,65.41 JP2.2
VCC  (via drill 0.3)
  Top 0.356: v13.34,95.25 12.86,94.77 12.86,84.77 13.02,84.61 13.02,73.82 12.17,72.97 12.17,56.89 12.3,56.77 12.3,56.26 12.17,56.14 12.17,37.83 13.65,36.35 13.65,21.59 v13.81,21.59 13.81,21.54 14.01,21.34 14.01,12.63 13.65,12.28 v13.65,12.22
  Bottom 0.152: 27.15,1.43 26.15,1.43 25.16,2.41 19.42,2.41 16.14,5.69 14.72,5.69 13.35,7.05 | C35.1 13.35,7.05 | IC8.4 12.5,8.14 13.35,7.28 13.35,7.05 | C36.1 33.8,14.27 33.8,12.65 33.45,12.31 33.45,12.17 29.68,12.17 27.95,10.45 27.95,10.12 IC9.4
  Bottom 0.356: 13.41,95.33 13.89,94.85 14.92,93.82 C2.1 14.47,93.67 15.76,92.39 22.42,92.39 23.62,93.6 23.62,93.62 23.57,93.67 23.45,93.67 23.47,93.65 C4.1 | 13.41,95.33 12.7,96.04 L3.1 | 13.73,12.14 12.54,10.95 12.54,9.9 IC8.4 | 13.73,12.14 16.67,15.08 17.3,15.08 U3.8 | 27.15,1.43 U$1.1 | v13.34,95.25 13.41,95.33 | v13.65,12.22 13.73,12.14 | v13.81,21.59 22.7,21.59 23.65,20.64 C31.1 23.81,20.48 25.24,19.05 27.78,19.05 28.57,18.26 28.57,16.51 30.38,16.51 31.87,15.02 C36.1
VEE  (via drill 0.3)
  Top 0.356: v3.49,57.63 2.7,58.42 v2.7,81.76 | v12.38,19.21 11.27,20.32 11.27,25.88 10.79,26.35 10.79,42.39 11.27,42.86 11.27,48.01 10.32,48.96 v10.32,56.52
  Bottom 0.152: 29.21,1.43 28.63,1.43 27.86,2.2 27.86,2.38 26.79,3.45 25.32,3.45 24.66,4.11 24.66,5.4 24.06,6 22.02,6 21.72,6.3 21.72,8.34 C37.2 | 12.54,15.4 12.54,16.68 13.18,17.32 13.18,18.41 v12.38,19.21
  Bottom 0.356: IC8.11 12.54,15.4 | 29.21,1.43 U$1.2 | L4.1 12.54,90.96 10.64,89.06 10.64,87.63 C9.2 | C10.2 14.13,87.63 10.79,87.63 C9.2 | v2.7,81.76 6.83,81.76 7.3,82.23 R1.1 7.46,82.39 7.46,84.45 10.48,87.47 C9.2 | v12.38,19.21 12.47,19.21 15.12,16.56 18.05,16.56 21.27,13.34 23.02,13.34 U3.4 23.18,13.18 23.65,12.7 24.13,12.7 24.45,12.38 24.45,9.88 24.45,9.82 24.45,9.8 24.45,8.95 23.7,8.95 C25.2 21.11,9.34 C37.2 20.92,9.02 | v10.32,56.52 9.21,57.63 v3.49,57.63
VREF
  Bottom 0.152: C41.1 4.29,46.99 5.4,45.88 9.05,45.88 9.37,46.2 9.37,46.83 IC7.3

## Text on the board
tPlace: + | + | +
bPlace: 1 | 2 | 3 | 4 | A | B | C | VCC | VEE | 3V3 | 3V3A | -2.5V | GND